# EAGLE design reader_breakout (EAGLE 7.2.0)
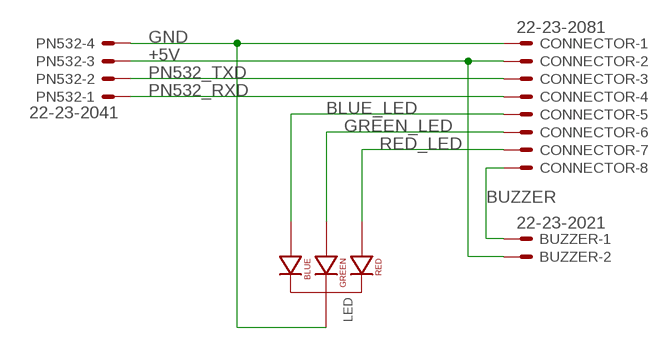
[diagram p0: schematic, sheet 1]

## Parts
BUZZER  22-23-2021  [22-23-2021]
CONNECTOR  22-23-2081  [22-23-2081]
LED  LED-RGB-CC-THRUCLEAR  [LED-RGB-THRU]
PN532  22-23-2041  [22-23-2041]

## Nets
+5V: BUZZER.2 CONNECTOR.2 PN532.3
BLUE_LED: CONNECTOR.5 LED.4(BLUE_CATHODE)
BUZZER: BUZZER.1 CONNECTOR.8
GND: CONNECTOR.1 LED.2(CATHODE) PN532.4
GREEN_LED: CONNECTOR.6 LED.3(GREEN_CATHODE)
PN532_RXD: CONNECTOR.4 PN532.1
PN532_TXD: CONNECTOR.3 PN532.2
RED_LED: CONNECTOR.7 LED.1(RED_CATHODE)

## Library data of the parts
BUZZER = con-molex:22-23-2021: .100" (2.54mm) Center Header - 2 Pin; MF: MOLEX; MPN: 22-23-2021; OC_FARNELL: 1462926; OC_NEWARK: 25C3832
CONNECTOR = con-molex:22-23-2081: .100" (2.54mm) Center Header - 8 Pin; MF: MOLEX; MPN: 22-23-2081; OC_FARNELL: 1756826; OC_NEWARK: 01C7592
LED = SparkFun-LED:LED-RGB-CC-THRU: RGB Through-hole common cathode LED SparkFun Storefront: COM-00105 (Clear) COM-09264 (Diffuse); PROD_ID: DIO-08418
PN532 = con-molex:22-23-2041: .100" (2.54mm) Center Header - 4 Pin; MF: MOLEX; MPN: 22-23-2041; OC_FARNELL: 1462920; OC_NEWARK: 38C0355

## Board
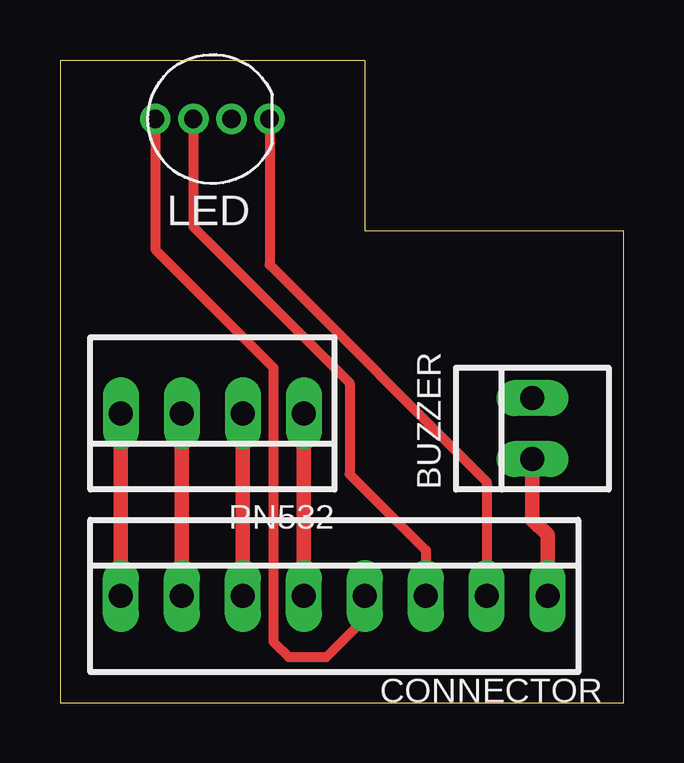
[diagram p1: board, top side]
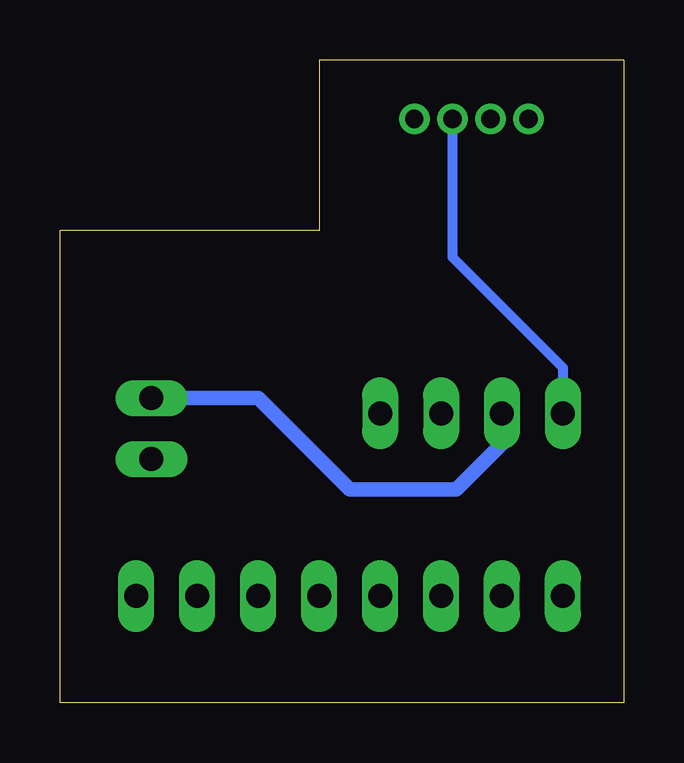
[diagram p2: board, bottom side, seen from below]

Size 23.5 x 26.8 mm. Coordinates in mm from the lower left corner, seen from the top.
Outline: 0,0 23.5,0 23.5,19.68 12.7,19.68 12.7,26.8 0,26.8 0,0
Copper layers (1*16): Top 0.035mm / dielectric 1.5mm / Bottom 0.035mm
Design rules "default": minimum track width 10mil, minimum drill 24mil, track to track 8mil, track to pad 8mil, pad to pad 8mil, via to via 8mil, smd to smd 8mil, copper to edge 40mil, drill to drill 8mil, minimum pad ring 10mil, minimum via ring 8mil, stop-mask expansion 4mil, vias tented up to drill 0mil, thermal gap 10mil

### Footprints (pad centres in the part's own frame; a part is rotated, then mirrored left to right if it is on the bottom)
22-23-2021 = drill 1 long: 1 -1.27,0; 2 1.27,0
22-23-2081 = drill 1 long: 1 -8.89,0; 2 -6.35,0; 3 -3.81,0; 4 -1.27,0; 5 1.27,0; 6 3.81,0; 7 6.35,0; 8 8.89,0
LED-RGB-THRU = drill 0.762 pad 1.016: 1 2.381,0; 2 0.794,0; 3 -0.794,0; 4 -2.381,0
22-23-2041 = drill 1 long: 1 -3.81,0; 2 -1.27,0; 3 1.27,0; 4 3.81,0

### Placement (x,y rotation side)
BUZZER  19.68,11.43 90 top
CONNECTOR  11.43,4.45 0 top
LED  6.35,24.33 0 top
PN532  6.35,12.06 180 top

### Tracks (layer width: path | path; a pad name or v marks a point on that pad's centre or on a via)
+5V
  Top 0.61: PN532.3 CONNECTOR.2
  Bottom 0.61: BUZZER.2 15.24,12.7 11.43,8.89 6.99,8.89 5.08,10.79 PN532.3
BLUE_LED
  Top 0.406: LED.4 3.97,18.89 8.89,13.97 8.89,2.54 9.53,1.91 11.11,1.91 13.02,3.81 13.02,4.13 CONNECTOR.5
BUZZER
  Top 0.61: CONNECTOR.8 20.32,6.99 19.68,7.62 BUZZER.1
GND
  Top 0.61: CONNECTOR.1 PN532.4
  Bottom 0.406: LED.2 7.14,18.57 2.54,13.97 PN532.4
GREEN_LED
  Top 0.406: LED.3 5.56,19.84 12.06,13.34 12.06,9.53 15.24,6.35 CONNECTOR.6 15.56,4.13
PN532_RXD
  Top 0.61: CONNECTOR.4 PN532.1
PN532_TXD
  Top 0.61: CONNECTOR.3 PN532.2
RED_LED
  Top 0.406: LED.1 8.73,18.26 17.78,9.21 CONNECTOR.7